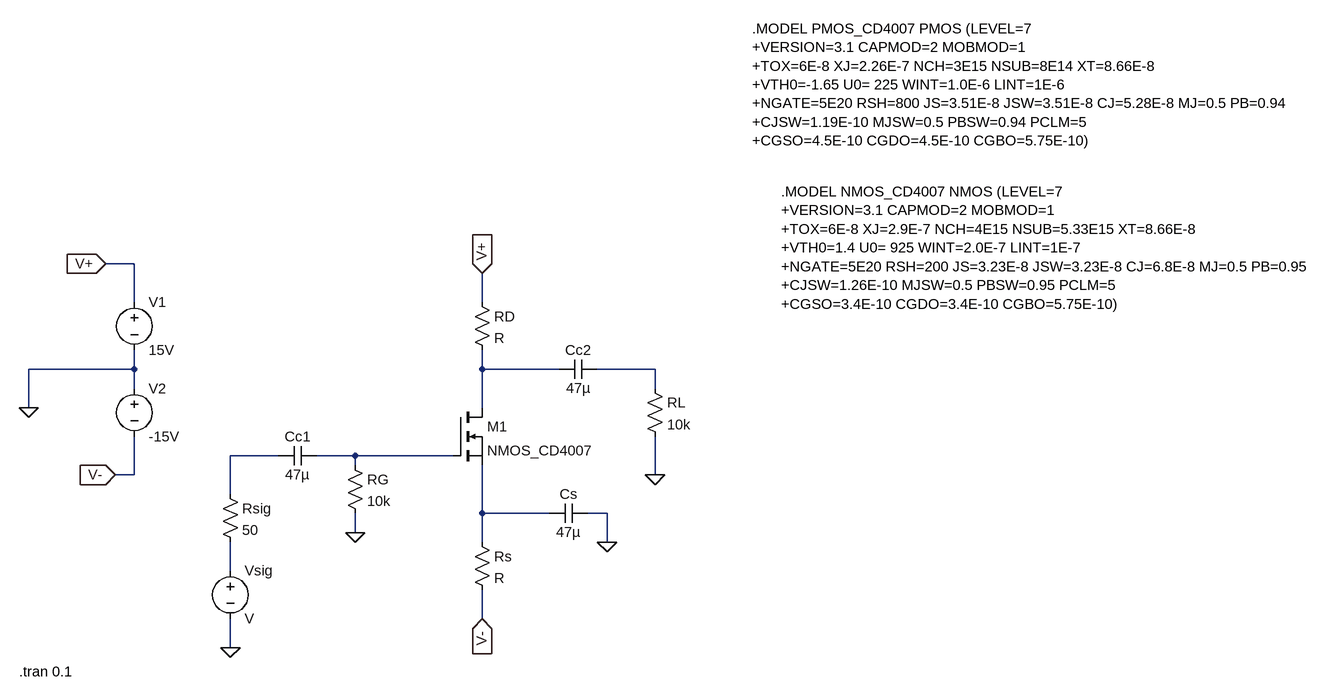
[diagram p0: schematic Simu_E.asc]
Simu_E.asc, the LTspice schematic file:
Version 4.1
SHEET 1 3268 680
WIRE -352 -144 -400 -144
WIRE -352 -80 -352 -144
WIRE 256 -80 256 -128
WIRE -352 32 -352 0
WIRE -352 32 -528 32
WIRE 256 32 256 0
WIRE 384 32 256 32
WIRE 544 32 448 32
WIRE -352 64 -352 32
WIRE 544 64 544 32
WIRE -528 96 -528 32
WIRE 256 96 256 32
WIRE -112 176 -192 176
WIRE 16 176 -48 176
WIRE 208 176 16 176
WIRE 16 192 16 176
WIRE -352 208 -352 144
WIRE -352 208 -384 208
WIRE 544 208 544 144
WIRE -192 240 -192 176
WIRE 256 272 256 192
WIRE 368 272 256 272
WIRE 464 272 432 272
WIRE 16 304 16 272
WIRE 256 320 256 272
WIRE 464 320 464 272
WIRE -192 368 -192 320
WIRE 256 448 256 400
WIRE -192 496 -192 448
FLAG 544 208 0
FLAG 464 320 0
FLAG 256 -128 V+
IOPIN 256 -128 In
FLAG 16 304 0
FLAG -192 496 0
FLAG 256 448 V-
IOPIN 256 448 In
FLAG -528 96 0
FLAG -384 208 V-
IOPIN -384 208 In
FLAG -400 -144 V+
IOPIN -400 -144 In
SYMBOL res 240 -96 R0
SYMATTR InstName RD
SYMBOL cap 448 16 R90
WINDOW 0 0 32 VBottom 2
WINDOW 3 32 32 VTop 2
SYMATTR InstName Cc2
SYMATTR Value 47µ
SYMBOL res 528 48 R0
SYMATTR InstName RL
SYMATTR Value 10k
SYMBOL cap 432 256 R90
WINDOW 0 0 32 VBottom 2
WINDOW 3 32 32 VTop 2
SYMATTR InstName Cs
SYMATTR Value 47µ
SYMBOL lib\\sym\\nmos 208 96 R0
SYMATTR InstName M1
SYMATTR Value NMOS_CD4007
SYMBOL res 240 304 R0
SYMATTR InstName Rs
SYMBOL res 0 176 R0
SYMATTR InstName RG
SYMATTR Value 10k
SYMBOL cap -48 160 R90
WINDOW 0 0 32 VBottom 2
WINDOW 3 32 32 VTop 2
SYMATTR InstName Cc1
SYMATTR Value 47µ
SYMBOL res -208 224 R0
SYMATTR InstName Rsig
SYMATTR Value 50
SYMBOL voltage -192 352 R0
SYMATTR InstName Vsig
SYMBOL voltage -352 -96 R0
WINDOW 123 0 0 Left 0
WINDOW 39 0 0 Left 0
SYMATTR InstName V1
SYMATTR Value 15V
SYMBOL voltage -352 48 R0
WINDOW 123 0 0 Left 0
WINDOW 39 0 0 Left 0
SYMATTR InstName V2
SYMATTR Value -15V
TEXT 2336 -264 Left 2 !.MODEL NMOS_CD4007 NMOS (LEVEL=7\n+VERSION=3.1 CAPMOD=2 MOBMOD=1\n+TOX=6E-8 XJ=2.9E-7 NCH=4E15 NSUB=5.33E15 XT=8.66E-8\n+VTH0=1.4 U0= 925 WINT=2.0E-7 LINT=1E-7\n+NGATE=5E20 RSH=200 JS=3.23E-8 JSW=3.23E-8 CJ=6.8E-8 MJ=0.5 PB=0.95\n+CJSW=1.26E-10 MJSW=0.5 PBSW=0.95 PCLM=5\n+CGSO=3.4E-10 CGDO=3.4E-10 CGBO=5.75E-10)
TEXT 2288 -536 Left 2 !.MODEL PMOS_CD4007 PMOS (LEVEL=7\n+VERSION=3.1 CAPMOD=2 MOBMOD=1\n+TOX=6E-8 XJ=2.26E-7 NCH=3E15 NSUB=8E14 XT=8.66E-8\n+VTH0=-1.65 U0= 225 WINT=1.0E-6 LINT=1E-6\n+NGATE=5E20 RSH=800 JS=3.51E-8 JSW=3.51E-8 CJ=5.28E-8 MJ=0.5 PB=0.94\n+CJSW=1.19E-10 MJSW=0.5 PBSW=0.94 PCLM=5\n+CGSO=4.5E-10 CGDO=4.5E-10 CGBO=5.75E-10)
TEXT -544 536 Left 2 !.tran 0.1

The netlist it stands for:
* Simu_E.asc
RD V+ N001 R
Cc2 N002 N001 47µ
RL N002 0 10k
Cs 0 N005 47µ
M1 N001 N004 N005 N005 NMOS_CD4007
Rs N005 V- R
RG N004 0 10k
Cc1 N004 N003 47µ
Rsig N003 N006 50
Vsig N006 0 V
V1 V+ 0 15V
V2 0 V- -15V
.model NMOS NMOS
.model PMOS PMOS
.lib standard.mos
.MODEL NMOS_CD4007 NMOS (LEVEL=7
+VERSION=3.1 CAPMOD=2 MOBMOD=1
+TOX=6E-8 XJ=2.9E-7 NCH=4E15 NSUB=5.33E15 XT=8.66E-8
+VTH0=1.4 U0= 925 WINT=2.0E-7 LINT=1E-7
+NGATE=5E20 RSH=200 JS=3.23E-8 JSW=3.23E-8 CJ=6.8E-8 MJ=0.5 PB=0.95
+CJSW=1.26E-10 MJSW=0.5 PBSW=0.95 PCLM=5
+CGSO=3.4E-10 CGDO=3.4E-10 CGBO=5.75E-10)
.MODEL PMOS_CD4007 PMOS (LEVEL=7
+VERSION=3.1 CAPMOD=2 MOBMOD=1
+TOX=6E-8 XJ=2.26E-7 NCH=3E15 NSUB=8E14 XT=8.66E-8
+VTH0=-1.65 U0= 225 WINT=1.0E-6 LINT=1E-6
+NGATE=5E20 RSH=800 JS=3.51E-8 JSW=3.51E-8 CJ=5.28E-8 MJ=0.5 PB=0.94
+CJSW=1.19E-10 MJSW=0.5 PBSW=0.94 PCLM=5
+CGSO=4.5E-10 CGDO=4.5E-10 CGBO=5.75E-10)
.tran 0.1
.backanno
.end